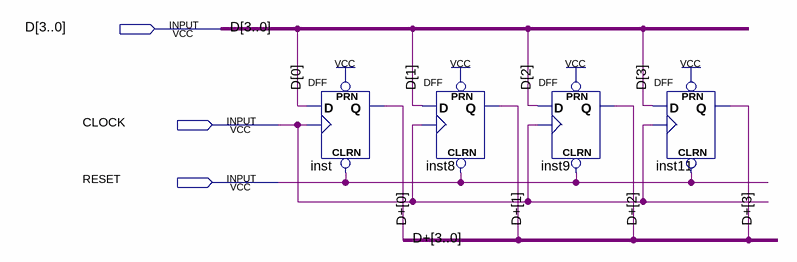
[diagram p0: schematic sheet]
// Quartus schematic 4bit_register.bdf as structural Verilog: 4 symbols, 3 pins
module \4bit_register  (
  input  [3:0] D,
  input  CLOCK,
  input  RESET
);

  wire [3:0] \D+ ;

  DFF inst (.CLRN(RESET), .CLK(CLOCK), .D(D[0]), .PRN(1'b1), .Q(\D+ [0]));
  DFF inst8 (.CLRN(RESET), .CLK(CLOCK), .D(D[1]), .PRN(1'b1), .Q(\D+ [1]));
  DFF inst9 (.CLRN(RESET), .CLK(CLOCK), .D(D[2]), .PRN(1'b1), .Q(\D+ [2]));
  DFF inst11 (.CLRN(RESET), .CLK(CLOCK), .D(D[3]), .PRN(1'b1), .Q(\D+ [3]));
endmodule
